# Altium schematic sheet ECE8873_sample.SchDoc
size 381 x 241 mm; SheetNumber: 1; SheetTotal: 2
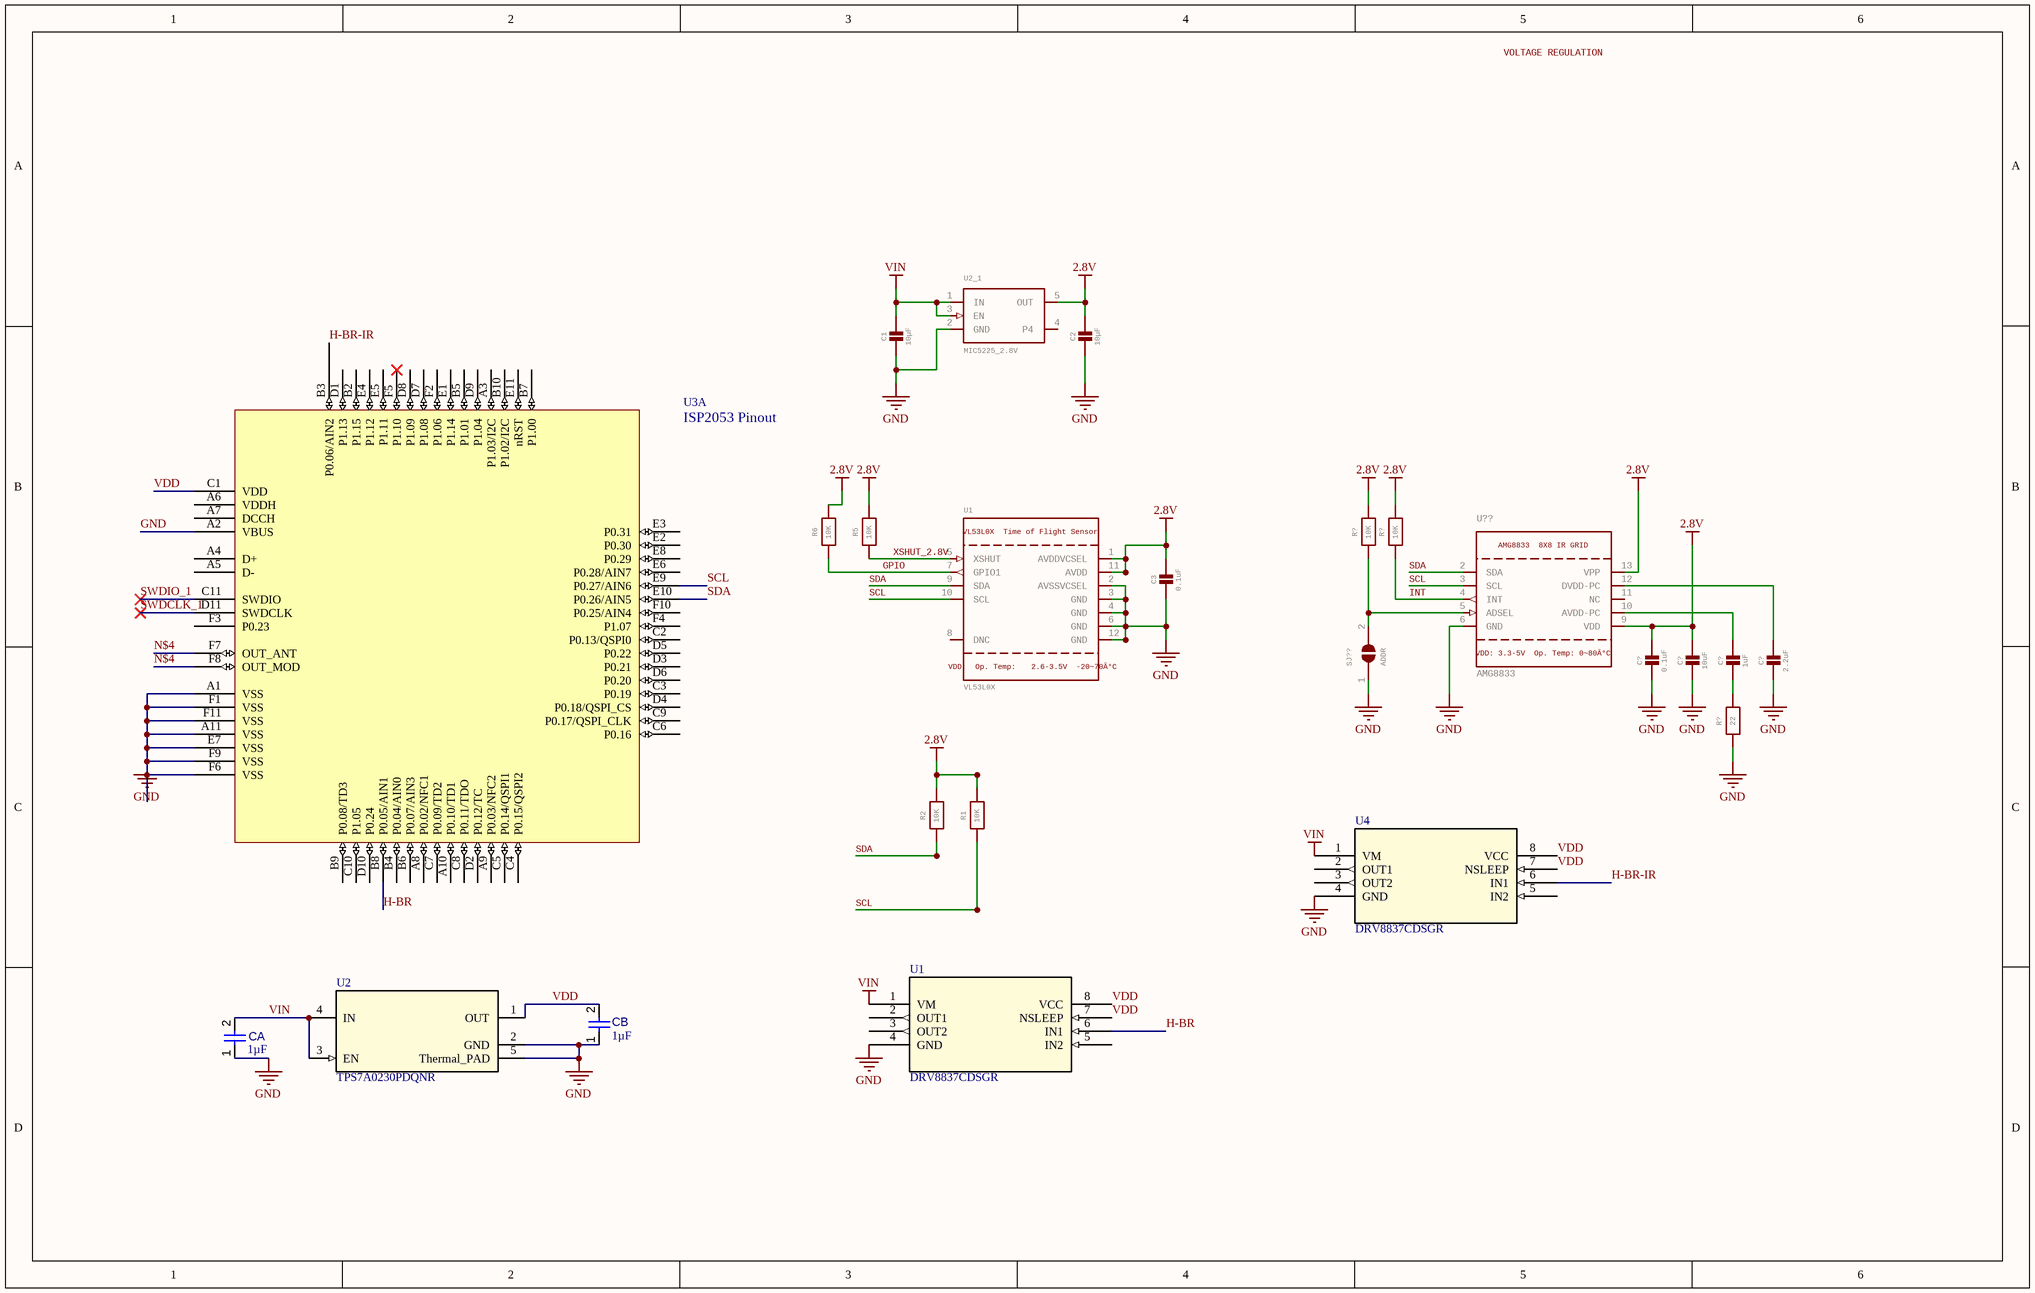
[diagram p0: ECE8873_sample.SchDoc]

## Parts
(Parts that share a designator on the sheet are numbered #1, #2 ... from top to bottom, then left to right.)
C1  10µF  [0805-NO]
C2  10µF  [0805-NO]
C3  0.1uF  [0805-NO]
C?#1  0.1uF  [0805-NO]
C?#2  10uF  [0805-NO]
C?#3  1uF  [0805-NO]
C?#4  2.2uF  [0805-NO]
CA  value 1µF  [CAPC1005X55X25LL05T10]  (hidden comment: Capacitor 1 uF +/- 10% 6.3 V 0402)
CB  value 1µF  [CAPC1005X55X25LL05T10]  (hidden comment: Capacitor 1 uF +/- 10% 6.3 V 0402)
R1  10K  [0805-NO]
R2  10K  [0805-NO]
R5  10K  [0805-NO]
R6  10K  [0805-NO]
R?#1  10K  [0805-NO]
R?#2  10K  [0805-NO]
R?#3  22  [0805-NO]
SJ??  ADDR  [SOLDERJUMPER_ARROW_NOPASTE]
U1#1  VL53L0X  VL53L0X
TimeofFlightSensor: VL53L0X / Time of Flight Sensor  VDD:
Op.Temp: VDD: / Op. Temp:  2.6-3.5V
-20~70Â°C: 2.6-3.5V / -20~70Â°C  [LGA12_ST]
U1#2  DRV8837CDSGR  [DSG8_P9X1P6_TEX]
U2  TPS7A0230PDQNR  [DQN0004A-MFG]
U2_1  MIC5225_2.8V  [SOT23-5]
U3  ISP1807  [ISP2053-AX]  (value not drawn)  (part A of 2)
U4  DRV8837CDSGR  [DSG8_P9X1P6_TEX]
U??  AMG8833  AMG8833
8X8IRGRID: AMG8833 / 8X8 IR GRID  VDD:3.3-5V
Op.Temp:0~80Â°C: VDD: 3.3-5V / Op. Temp: 0~80Â°C  [AMG8833]

## Nets
2.8V: C2.1 C3.1 C?#1.1 C?#2.1 R1.2 R2.2 R5.2 R6.2 R?#1.2 R?#2.2 U1#1.1(AVDDVCSEL) U1#1.11(AVDD) U2_1.5(OUT) U??.9(VDD) U??.13(VPP)
GND: C1.2 C2.2 C3.2 C?#1.2 C?#2.2 C?#4.2 CA.1 CB.1 R?#3.1 SJ??.1 U1#1.2(AVSSVCSEL) U1#1.3(GND) U1#1.4(GND) U1#1.6(GND) U1#1.12(GND) U1#2.4(GND) U2.2(GND) U2.5(Thermal_PAD) U2_1.2(GND) U3.A1(VSS) U3.A2(VBUS) U3.A11(VSS) U3.E7(VSS) U3.F1(VSS) U3.F6(VSS) U3.F9(VSS) U3.F11(VSS) U4.4(GND) U??.6(GND)
VIN: C1.1 CA.2 U1#2.1(VM) U2.3(EN) U2.4(IN) U2_1.1(IN) U2_1.3(EN) U4.1(VM)
GPIO: R6.1 U1#1.7(GPIO1)
H-BR: U1#2.6(IN1) U3.B8(P0.05/AIN1)
H-BR-IR: U4.6(IN1)
INT: R?#2.1 U??.4(INT)
N$4: U3.F7(OUT_ANT) U3.F8(OUT_MOD)
SCL: R1.1 U1#1.10(SCL) U3.E9(P0.27/AIN6) U??.3(SCL)
SDA: R2.1 U1#1.9(SDA) U3.E10(P0.26/AIN5) U??.2(SDA)
SWDCLK_1: U3.D11(SWDCLK)
SWDIO_1: U3.C11(SWDIO)
VDD: CB.2 U1#2.7(NSLEEP) U1#2.8(VCC) U2.1(OUT) U3.C1(VDD) U4.7(NSLEEP) U4.8(VCC)
XSHUT_2.8V: R5.1 U1#1.5(XSHUT)
NetC?#3_1: C?#3.1 U??.10(AVDD-PC)
NetC?#3_2: C?#3.2 R?#3.2
NetC?#4_1: C?#4.1 U??.12(DVDD-PC)
NetR?#1_1: R?#1.1 SJ??.2 U??.5(ADSEL)

Not connected (* = marked no-connect by the designer): U1#1 8(DNC); U1#2 2(OUT1) 3(OUT2) 5(IN2); U2_1 4(P4); U3 A3(P1.03/I2C) A4(D+) A5(D-) A6(VDDH) A7(DCCH) A8(P0.02/NFC1) A9(P0.03/NFC2) A10(P0.10/TD1) B2(P1.15) B3(P0.06/AIN2) B4(P0.04/AIN0) B5(P1.01) B6(P0.07/AIN3) B7(P1.00) B9(P0.08/TD3) B10(P1.02/I2C) C2(P0.13/QSPI0) C3(P0.19) C4(P0.15/QSPI2) C5(P0.14/QSPI1) C6(P0.16) C7(P0.09/TD2) C8(P0.11/TDO) C9(P0.17/QSPI_CLK) C10(P1.05) D1(P1.13) D2(P0.12/TC) D3(P0.21) D4(P0.18/QSPI_CS) D5(P0.22) D6(P0.20) D7(P1.08) D8(P1.09) D9(P1.04) D10(P0.24) E1(P1.14) E2(P0.30) E3(P0.31) E4(P1.12) E5(P1.11) E6(P0.28/AIN7) E8(P0.29) E11(nRST) F2(P1.06) F3(P0.23) F4(P1.07) F5(P1.10)* F10(P0.25/AIN4); U4 2(OUT1) 3(OUT2) 5(IN2); U?? 11(NC)

## Notes on the sheet
- VOLTAGE REGULATION
- Labels drawn without touching a wire or pin: H-BR-IR
- (in symbol ISP2053_Pinout_New, part A) ISP2053 Pinout

## Library data of the parts
C1-C3 C?#1-C?#4 = CAP_CERAMIC0805-NOOUTLINE: Ceramic Capacitors   For new designs, use the packages preceded by an '_' character since they are more reliable:   The following footprints should be used on most boards: _0402 - Standard footprint for regular board layouts  _0603 - Standard footprint for regular board layouts  _0805 - Standard footprint for regular board layouts  _1206 - Standard footprint for regular board layouts       For extremely tight-pitch boards where space is at a premium, the following 'micro-pitch' footprints can be used (smaller pads, no silkscreen outline, etc.): _0402MP - Micro-pitch footprint for very dense/compact boards  _0603MP - Micro-pitch footprint for very dense/compact boards  _0805MP - Micro-pitch footprint for very dense/compact boards  _1206MP - Micro-pitch footprint for very dense/compact boards; GateName_1: G$1; SymbolName_1: CAPACITOR; DeviceName: 0805-NOOUTLINE; LibraryName: microbuilder; DeviceSetName: CAP_CERAMIC
CA CB = CMP-001-00008-6: Chip Capacitor, 1 uF, +/- 10%, 6.3 V, 0402 (1005 Metric); Capacitor Type: Ceramic; Voltage Rating: 6.3V; Max Operating Temperature: 85°C; Mounting Technology: SM; Tolerance: 10%; Case/Package: 0402; RoHS Compliant: True; Min Operating Temperature: -55°C; Pins: 2
R1 R2 R5 R6 R?#1-R?#3 = RESISTOR0805_NOOUTLINE: Resistors   For new designs, use the packages preceded by an '_' character since they are more reliable:   The following footprints should be used on most boards: _0402 - Standard footprint for regular board layouts  _0603 - Standard footprint for regular board layouts  _0805 - Standard footprint for regular board layouts  _1206 - Standard footprint for regular board layouts       For extremely tight-pitch boards where space is at a premium, the following 'micro-pitch' footprints can be used (smaller pads, no silkscreen outline, etc.): _0402MP - Micro-pitch footprint for very dense/compact boards  _0603MP - Micro-pitch footprint for very dense/compact boards  _0805MP - Micro-pitch footprint for very dense/compact boards  _1206MP - Micro-pitch footprint for very dense/compact boards; GateName_1: G$1; SymbolName_1: RESISTOR; DeviceName: 0805_NOOUTLINE; LibraryName: microbuilder; DeviceSetName: RESISTOR
SJ?? = SOLDERJUMPER: SMD Solder JUMPER   Solder the two pads together to create a connection, or remove the solder to break it.REFLOW - Use this footprint for solder paste and reflow ovens. WAVE - Use this footprint for hand-soldering (larger pads).    CLOSED - Has a trace between the two pads to ensure it is closed by default.  The trace needs to be cut to disable the jumper, and can be closed again by creating a solder bridge between the two pads.; GateName_1: 1; BOM: EXCLUDE; SymbolName_1: SOLDERJUMPER; LibraryName: microbuilder; DeviceSetName: SOLDERJUMPER
U1#1 = VL53L0X: VL53L0X - Laser Time of Flight Sensor (2M range); GateName_1: G$1; SymbolName_1: VL53L0X; LibraryName: microbuilder; DeviceSetName: VL53L0X
U1#2 U4 = DRV8837CDSGR: 12-V, 1-A H-bridge motor driver 8-WSON -40 to 85; Manufacturer_Name: Texas Instruments; Copyright: Copyright (C) 2025 Ultra Librarian. All rights reserved.; Manufacturer_Part_Number: DRV8837CDSGR; Datasheet: https://www.ti.com/lit/gpn/drv8837c; RefDes: RefDes; Type: Type
U2 = TPS7A0230PDQNR: No Description Available; Mfr_Name: Texas Instruments; TYPE: TYPE; RefDes: RefDes
U2_1 = VREG_SOT23-5: SOT23-5 Fixed Voltage Regulators      Part	Current Out	V Out	V In	V Dropout	Î¸JA (Â°C/W)	TJ (Â°C)	Digikey Part No.	     ADP121	  150mA	  3.3V	  3.4-5.5V	  0.09V @ 150mA	  --	  --	  ADP121-AUJZ33R7CT-ND	     ADP121	  150mA	  3.0V	  3.1-5.5V	  0.09V @ 150mA	  --	  --	  ADP121-AUJZ30R7CT-ND	     ADP122	  300mA	  3.3V	  3.4-5.5V	  0.085V @ 300mA	  --	  --	  ADP122AUJZ-3.3-R7CT-ND	     ADP1712	  300mA	  3.3V	  3.5-5.5V	  0.17V @ 300mA	  --	  --	  ADP1712AUJZ-3.3-R7TR-ND	     AP7311 (Low Cost)	  150mA	  3.3V	  3.5-6V	  0.15V @ 150mA	  --	  --	  AP7311-33WG-7DICT-ND	     LD39015M18R	  150mA	  1.8V	  1.9V-5.5V	  0.08V @ 100mA	  --	  --	  497-6977-1-ND	     LP2985A-33DBVR	  150mA	  3.3V	  3.3-16V	  0.28V @ 150mA	  206	  150	  296-18479-1-ND	     MCP1824T-3302E/OT	  300mA	  3.3V	  3.5V-6V	  0.2V @ 300mA	  --	  --	  MCP1824T-3302E/OTCT-ND	     MIC5205-2.5YM5 TR	  150mA	  2.5V	  2.7-16V	  0.165V @ 150mA	  --	  --	  576-1257-2-ND	     MIC5205-3.0YM5 TR	  150mA	  3.0V	  3.2V-16V	  0.165V @ 150mA	  --	  --	  576-1258-2-ND	     MIC5205-3.3YM5 TR	  150mA	  3.3V	  3.5V-16V	  0.165V @ 150mA	  --	  --	  576-1259-2-ND	     TPS780330220	  150mA	  3.3V+2.2V	  3.6-5.5V	  250mV Max	  --	  --	  296-23332-1-ND	     TDA3663/N1,135	  100mA	  3.3V	  3.5-45V	  0.18V @ 50mA	  --	  --	  568-5343-1-ND	     	  	  	  	  	  	  	  	     	  	  	  	  	  	  	  	   Max operating temp can be calculated using Î¸JA, TJ (max junction temperature), and power in watts.  Set the "Maximum Ambient Temperature" until it reaches TJ ("Max Junction Temperature"), which is the absolute limit for safe use of the regulator: Heat Sink Temperature Calculator   For example, With 12V source into a 3.3V LP2985 and a 30mA load, we are dissipating (12V-3.3V) * 0.03A = 0.261W.  With a Î¸JA of 206 Â°C/W, a TJ of 150Â°C, and 261mW we can safely use the chip without a heat sink up to 75Â°C (=147.1Â°C Junction Temperature).; GateName_1: G$1; SymbolName_1: VREG_SOT23-5; LibraryName: microbuilder; DeviceSetName: VREG_SOT23-5
U3 = ISP2053_Pinout_New: ISP Smart Bluetooth Module; BOI-Metric: QFN 8 x 8; DESIG: BLE Module; FAB: Insight SiP; BOI: QFN 8 x 8; ISP_PART: ISP1807
U?? = AMG8833: AMG8833 8x8 IR Grid Sensor    Viewing Angle: ~60Â°  Temp Accuracy: +/-2-3Â°C (high/low gain); GateName_1: G$1; SymbolName_1: AMG8833; LibraryName: microbuilder; DeviceSetName: AMG8833